# EasyEDA schematic 1-Schematic_CarFan_controller_v2.0.json
TITLE: Sheet_1; REV: 1.0; Date: 2020-03-25; Sheet: 1/1; Drawn By: kt315ua; Company: Your Company
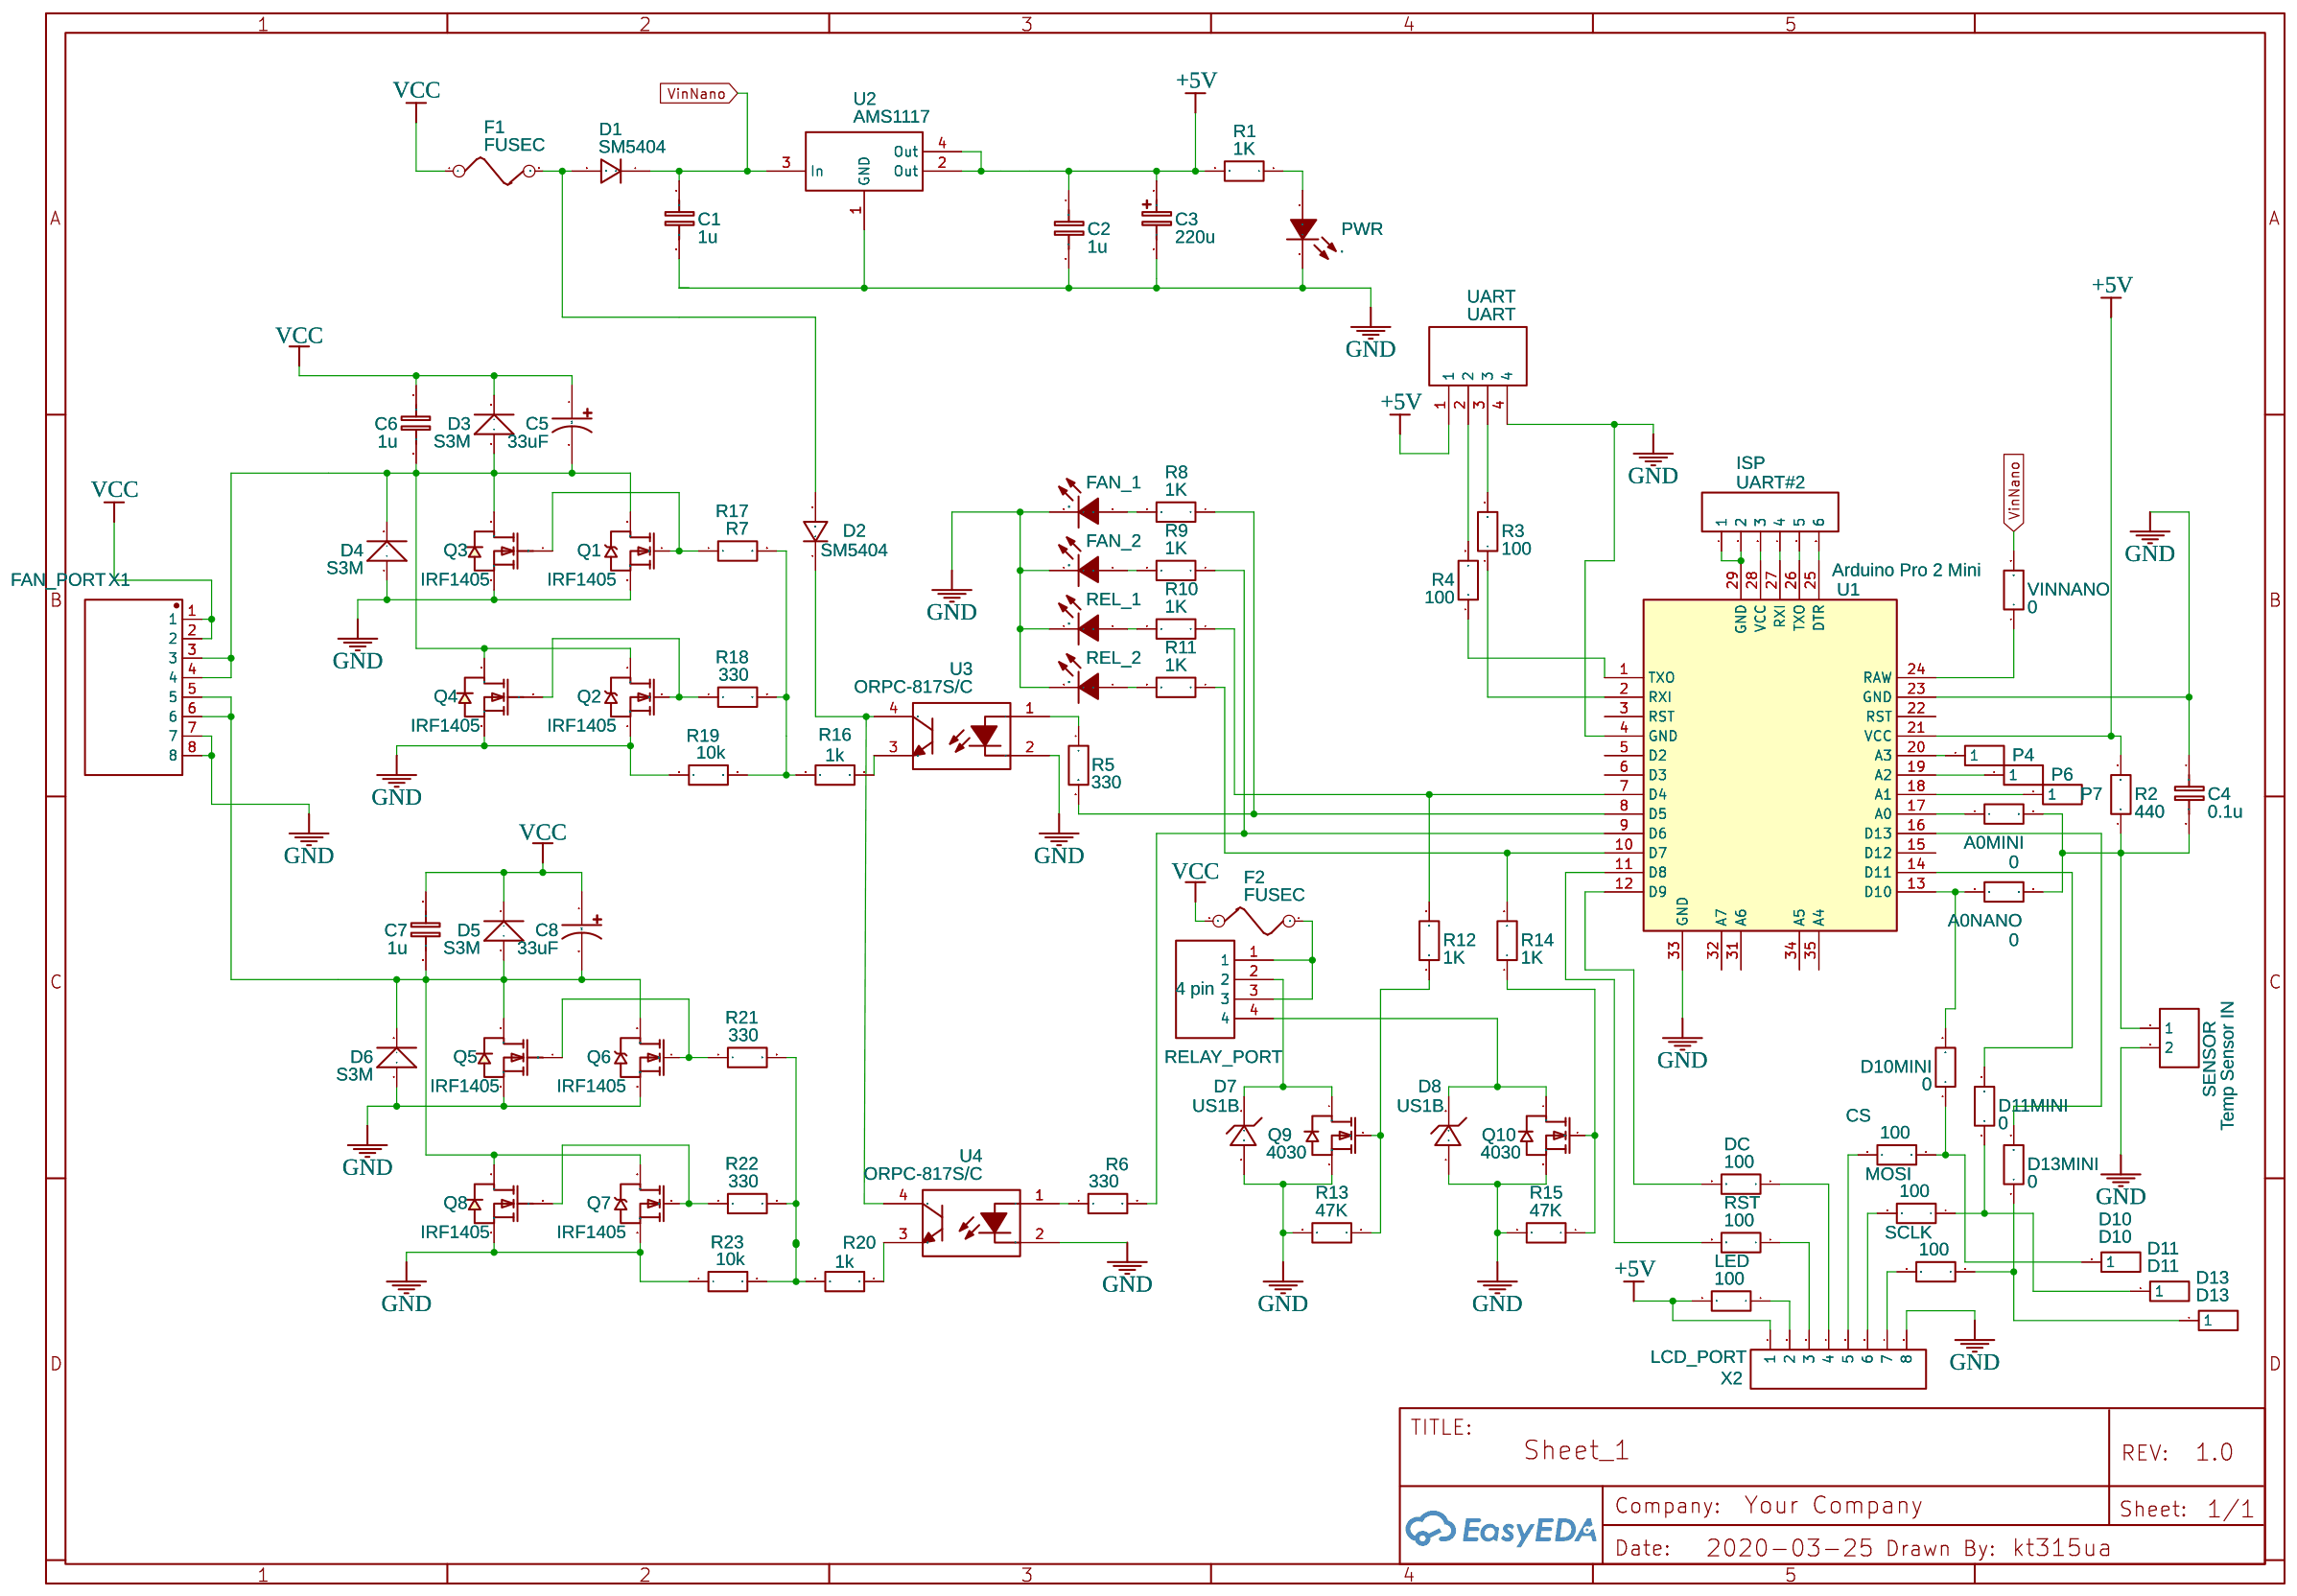
[diagram p0: schematic sheet]

## Parts
A0MINI  0  [1206]
A0NANO  0  [1206]
C1  1u  [1206]
C2  1u  [1206]
C3  220u  [CAP-D6.3XH5.5]
C4  0.1u  [1206]
C5  33uF  [CAP-SMD_BD10.0-L10.3-W10.3-FD]
C6  1u  [1206]
C7  1u  [1206]
C8  33uF  [CAP-SMD_BD10.0-L10.3-W10.3-FD]
CS  100  [1206]
D1  SM5404  [DO-213AB_L5.0-W2.5-RD]
D2  SM5404  [DO-213AB_L5.0-W2.5-RD]
D3  S3M  [DO-214AB]
D4  S3M  [DO-214AB]
D5  S3M  [DO-214AB]
D6  S3M  [DO-214AB]
D7  US1B  [SMA(DO-214AC)]
D8  US1B  [SMA(DO-214AC)]
D10  D10  [HDR-1X1/2.54]
D10MINI  0  [1206]
D11  D11  [HDR-1X1/2.54]
D11MINI  0  [1206]
D13  D13  [HDR-1X1/2.54]
D13MINI  0  [1206]
DC  100  [1206]
F1  FUSEC  [1206]
F2  FUSEC  [1206]
FAN_1  .  [LED1206-R-RD]
FAN_2  .  [LED1206-R-RD]
FAN_PORT  X1  [KF2510-8A]
ISP  UART#2  [HDR-6X1/2.54]
LCD_PORT  X2  [HDR-8X1/2.54]
LED  100  [1206]
MOSI  100  [1206]
P4  D13  [HDR-1X1/2.54]
P6  D13  [HDR-1X1/2.54]
P7  D13  [HDR-1X1/2.54]
PWR  .  [LED1206-R-RD]
Q1  IRF1405  [TO-263-3_L10.2-W10.7-P5.08-LS16.2-BR]
Q2  IRF1405  [TO-263-3_L10.2-W10.7-P5.08-LS16.2-BR]
Q3  IRF1405  [TO-220-3_L10.0-W4.5-P2.54-L]
Q4  IRF1405  [TO-220-3_L10.0-W4.5-P2.54-L]
Q5  IRF1405  [TO-220-3_L10.0-W4.5-P2.54-L]
Q6  IRF1405  [TO-263-3_L10.2-W10.7-P5.08-LS16.2-BR]
Q7  IRF1405  [TO-263-3_L10.2-W10.7-P5.08-LS16.2-BR]
Q8  IRF1405  [TO-220-3_L10.0-W4.5-P2.54-L]
Q9  4030  [DPAK_L6.5-W6.0-P2.29-LS9.9-BR]
Q10  4030  [DPAK_L6.5-W6.0-P2.29-LS9.9-BR]
R1  1K  [1206]
R2  440  [1206]
R3  100  [1206]
R4  100  [1206]
R5  330  [1206]
R6  330  [1206]
R8  1K  [1206]
R9  1K  [1206]
R10  1K  [1206]
R11  1K  [1206]
R12  1K  [1206]
R13  47K  [1206]
R14  1K  [1206]
R15  47K  [1206]
R16  1k  [1206]
R17  R7  [1206]
R18  330  [1206]
R19  10k  [1206]
R20  1k  [1206]
R21  330  [1206]
R22  330  [1206]
R23  10k  [1206]
REL_1  .  [LED1206-R-RD]
REL_2  .  [LED1206-R-RD]
RELAY_PORT  4 pin  [DIP-1X4P2.54]
RST  100  [1206]
SCLK  100  [1206]
SENSOR  Temp Sensor IN  [HDR-TH_2P-P2.54-V-M]
U1  Arduino Pro 2 Mini  [PRO_MINI_FOOTPRINT]
U2  AMS1117  [SOT-223]
U3  ORPC-817S/C  [SOP-4_L6.5-W4.6-P2.54-LS10.2-BL]
U4  ORPC-817S/C  [SOP-4_L6.5-W4.6-P2.54-LS10.2-BL]
UART  UART  [DIP-1X4P2.54]
VINNANO  0  [1206]

## Library data of the parts
A0MINI A0NANO CS D10MINI D11MINI D13MINI DC LED MOSI R1-R6 R8-R23 RST SCLK VINNANO = Res_1206(1/4W)_EU
C1 C2 C4 C6 C7 = Cap_1206_EU
C3 = Cap_Electrolytic(SMD)_D6.3XH5.5_EU: Contributor: EasyEDA
C5 C8 = EEEFK2A330P: Supplier: LCSC; Supplier Part: C178571; Manufacturer: PANASONIC; Contributor: LCSC
D1 D2 = SM5404: Supplier: LCSC; Supplier Part: C212808; Manufacturer: (DIOTEC); Contributor: LCSC
D3-D6 = DDO-214AB
D7 D8 = SMAZ12-13-F(SMA(DO-214AC)): Supplier: LCSC; Manufacturer: DIODES; Manufacturer Part: SMAZ12-13-F; Contributor: EasyEDA; Supplier Part: C110523
D10 D11 D13 P4 P6 P7 = Header-Male-2.54_1x1: Supplier: LCSC; Manufacturer: ReliaPro; Supplier Part: C81276
F1 F2 = FUSEC
FAN_1 FAN_2 PWR REL_1 REL_2 = KT-1206Red LED: Supplier: LCSC; Manufacturer: KENTO; image: //image.lceda.cn/szlcsc/C49018.jpg; Supplier Part: C49018; LCSC Assembly: Yes; SMT Type: Extend
FAN_PORT = Connector_KF2510-8A-Fix: Supplier Part: C27837; Supplier: LCSC; Manufacturer: BOOMELE; Manufacturer Part: Connector KF2510-8A; Contributor: nimishnirmalbiz
ISP = Header-Female-2.54_1x6: Supplier: LCSC; Manufacturer: BOOMELE; Manufacturer Part: Female header 1*6p; Supplier Part: C40877
LCD_PORT = Header-Female-2.54_1x8: Supplier: LCSC; Manufacturer: BOOMELE; Manufacturer Part: Female headerHDR1X8-2.54; Supplier Part: C27438
Q1 Q2 Q6 Q7 = IRF1405ZSTRLPBF: Supplier: LCSC; Supplier Part: C459941; Manufacturer: Infineon Technologies; Contributor: LCSC
Q3-Q5 Q8 = IRF1405PBF: Supplier: LCSC; Manufacturer: IR; image: //image.lceda.cn/szlcsc/C2559.jpg; Supplier Part: C2559
Q9 Q10 = STD8N60DM2: Supplier: LCSC; Supplier Part: C457504; Manufacturer: STMicroelectronics; Contributor: LCSC
RELAY_PORT UART = 220S-1*4P H=8.5MM Ytype Gold-plated: Supplier: LCSC; Manufacturer: Ckmtw; Contributor: LCSC; Supplier Part: C124413
SENSOR = Header-Female-2.54_1x2: Supplier: LCSC; Manufacturer: BOOMELE; Manufacturer Part: 2.54-1*2PFemale; image: //image.lceda.cn/szlcsc/C49661.jpg; Supplier Part: C49661
U1 = Arduino Pro 2 Mini_328_-_3.3V: sourceId: 1T5FDZYC8; Contributor: Lev Kuzmin
U2 = AMS1117: sourceId: dwIGgezVh; Supplier Part: C6186; Contributor: dvmichurin
U3 U4 = ORPC-817S/C: Supplier: LCSC; Supplier Part: C231230; Manufacturer: Orient; Contributor: LCSC

## Nets
+5V: C2.1 C3.1 LCD_PORT.1 LED.2 R1.2 R2.2 U1.21(VCC) U2.2(Out) U2.4(Out) UART.1
GND: C1.2 C2.2 C3.2 C4.1 D4.1(+) D6.1(+) D7.1(A) D8.1(A) FAN_1.2(K) FAN_2.2(K) FAN_PORT.7 FAN_PORT.8 LCD_PORT.8 PWR.2(K) Q1.3(S) Q2.3(S) Q3.3(S) Q4.3(S) Q5.3(S) Q6.3(S) Q7.3(S) Q8.3(S) Q9.3(S) Q10.3(S) R13.2 R15.2 R19.1 R23.1 REL_1.2(K) REL_2.2(K) SENSOR.2 U1.4(GND) U1.23(GND) U1.33(GND) U2.1(GND) U3.2 U4.2 UART.4
VCC: C5.1 C6.1 C7.1 C8.1 D3.2(-) D5.2(-) F1.1 F2.2 FAN_PORT.1 FAN_PORT.2
VinNano: C1.1 D1.1 U2.3(In) VINNANO.2
Net-(A0MINI-1): A0MINI.1 U1.17(A0)
Net-(A0MINI-2): A0MINI.2 A0NANO.2 C4.2 R2.1 SENSOR.1
Net-(A0NANO-1): A0NANO.1 D10MINI.2 U1.13(D10)
Net-(C5-2): C5.2 C6.2 D3.1(+) D4.2(-) FAN_PORT.3 FAN_PORT.4 Q1.2(D) Q2.2(D) Q3.2(D) Q4.2(D)
Net-(C7-2): C7.2 C8.2 D5.1(+) D6.2(-) FAN_PORT.5 FAN_PORT.6 Q5.2(D) Q6.2(D) Q7.2(D) Q8.2(D)
Net-(CS-1): CS.1 D10.1 D10MINI.1
Net-(CS-2): CS.2 LCD_PORT.5
Net-(D1-2): D1.2 D2.2 F1.2
Net-(D2-1): D2.1 U3.4 U4.4
Net-(D7-2): D7.2(K) Q9.4(D) RELAY_PORT.2
Net-(D8-2): D8.2(K) Q10.4(D) RELAY_PORT.4
Net-(D11-1): D11.1 D11MINI.1 MOSI.1
Net-(D11MINI-2): D11MINI.2 U1.14(D11)
Net-(D13-1): D13.1 D13MINI.1 SCLK.1
Net-(D13MINI-2): D13MINI.2 U1.16(D13)
Net-(DC-1): DC.1 LCD_PORT.4
Net-(DC-2): DC.2 U1.12(D9)
Net-(F2-1): F2.1 RELAY_PORT.1 RELAY_PORT.3
Net-(FAN_1-1): FAN_1.1(A) R8.2
Net-(FAN_2-1): FAN_2.1(A) R9.2
Net-(ISP-1): ISP.1 ISP.2 U1.29(GND)
Net-(ISP-3): ISP.3 U1.28(VCC)
Net-(ISP-4): ISP.4 U1.27(RXI)
Net-(ISP-5): ISP.5 U1.26(TXO)
Net-(ISP-6): ISP.6 U1.25(DTR)
Net-(LCD_PORT-2): LCD_PORT.2 LED.1
Net-(LCD_PORT-3): LCD_PORT.3 RST.1
Net-(LCD_PORT-6): LCD_PORT.6 MOSI.2
Net-(LCD_PORT-7): LCD_PORT.7 SCLK.2
Net-(P4-1): P4.1 U1.20(A3)
Net-(P6-1): P6.1 U1.19(A2)
Net-(P7-1): P7.1 U1.18(A1)
Net-(PWR-1): PWR.1(A) R1.1
Net-(Q1-1): Q1.1(G) Q3.1(G) R17.1
Net-(Q2-1): Q2.1(G) Q4.1(G) R18.1
Net-(Q5-1): Q5.1(G) Q6.1(G) R21.1
Net-(Q7-1): Q7.1(G) Q8.1(G) R22.1
Net-(Q9-1): Q9.1(G) R12.1 R13.1
Net-(Q10-1): Q10.1(G) R14.1 R15.1
Net-(R3-1): R3.1 U1.2(RXI)
Net-(R3-2): R3.2 UART.3
Net-(R4-1): R4.1 U1.1(TXO)
Net-(R4-2): R4.2 UART.2
Net-(R5-1): R5.1 U3.1
Net-(R5-2): R5.2 R8.1 U1.8(D5)
Net-(R6-1): R6.1 U4.1
Net-(R6-2): R6.2 R9.1 U1.9(D6)
Net-(R10-1): R10.1 R12.2 U1.7(D4)
Net-(R10-2): R10.2 REL_1.1(A)
Net-(R11-1): R11.1 R14.2 U1.10(D7)
Net-(R11-2): R11.2 REL_2.1(A)
Net-(R16-1): R16.1 U3.3
Net-(R16-2): R16.2 R17.2 R18.2 R19.2
Net-(R20-1): R20.1 U4.3
Net-(R20-2): R20.2 R21.2 R22.2 R23.2
Net-(RST-2): RST.2 U1.11(D8)
Net-(U1-24): U1.24(RAW) VINNANO.1

Not connected (* = marked no-connect by the designer): U1 3(RST) 5(D2) 6(D3) 15(D12) 22(RST) 31(A6) 32(A7) 34(A5) 35(A4)
